# Altium schematic sheet МИЭТ_8161930_003_Э3_Лист_2.SchDoc: МИЭТ_8161930.003.Э3
size A4 portrait; Author: Архангельская П.Д.; SheetNumber: 2; SheetTotal: 2
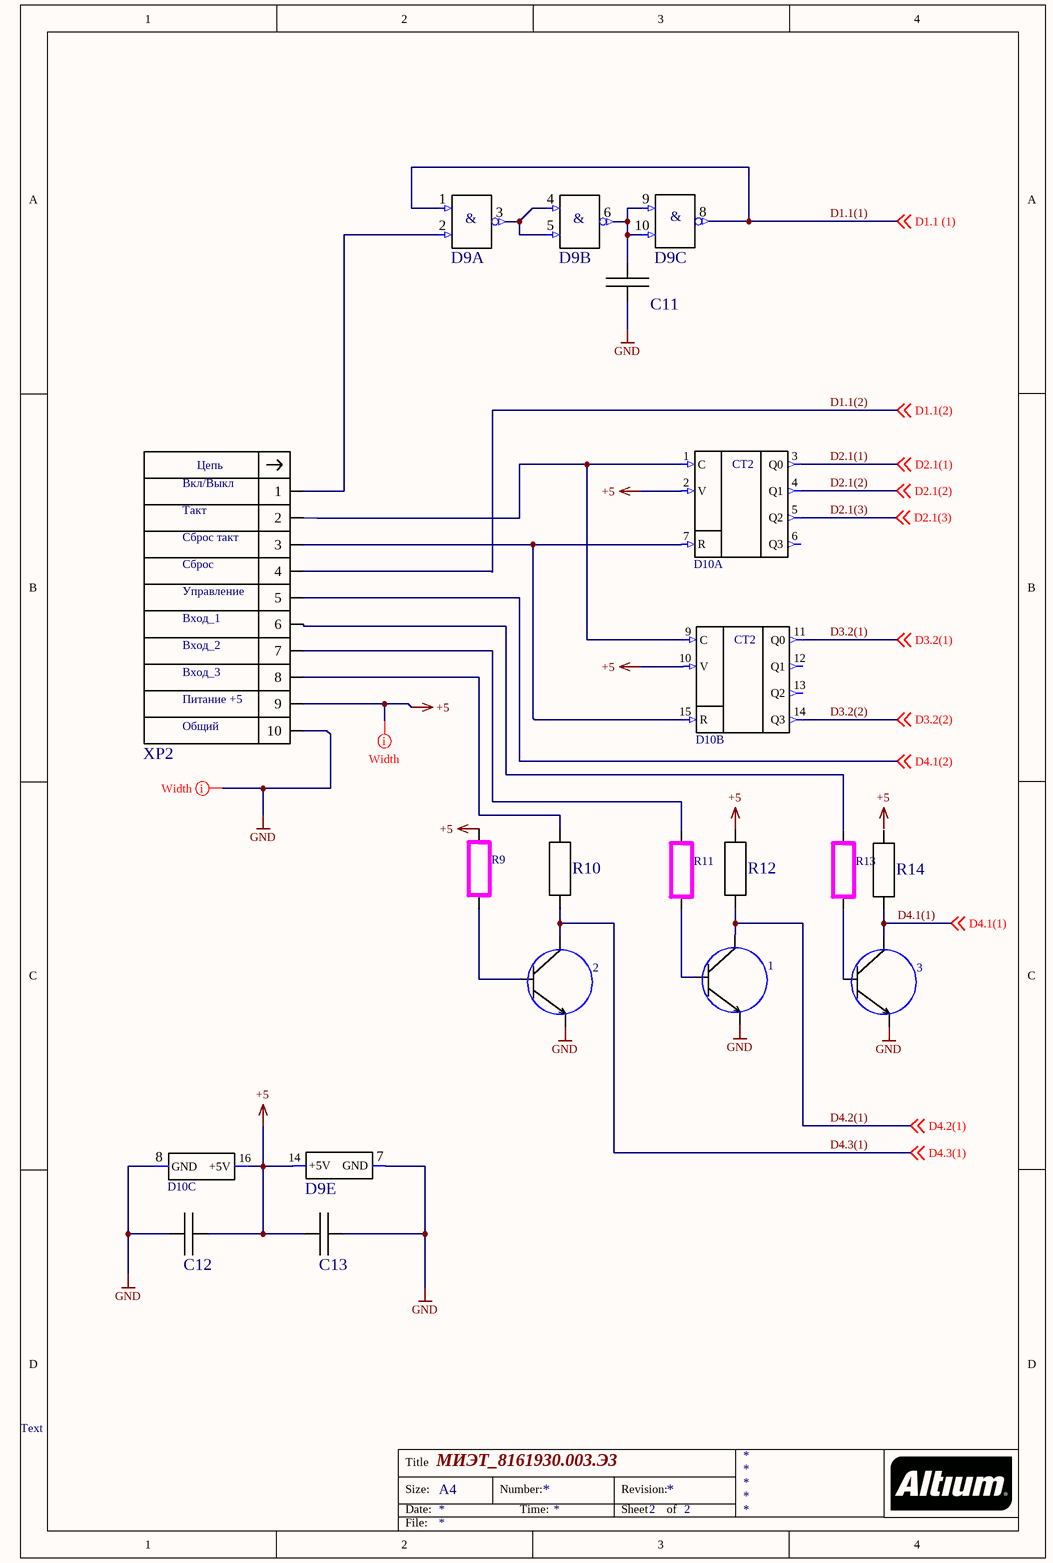
[diagram p0: МИЭТ_8161930_003_Э3_Лист_2.SchDoc]

## Parts
1  Транзистор  [SOT89-150P340X160-3N]  (value not drawn)
2  Транзистор  [SOT89-150P340X160-3N]  (value not drawn)
3  Транзистор  [SOT89-150P340X160-3N]  (value not drawn)
C11  (no value)  [0805_N]
C12  (no value)  [0805_N]
C13  (no value)  [0805_N]
D9  74AC00SC  [SO14-N]  (value not drawn)  (parts A,B,C,E of 5)
D10  MC14520BDWG  [SOIC-16W-N]  (value not drawn)  (parts A,B,C of 3)
R9  Резистор  [CAPC3225X06N]  (value not drawn)
R10  0805  [RES_0805_2012_N]  (value not drawn)
R11  Резистор  [CAPC3225X06N]  (value not drawn)
R12  0805  [RES_0805_2012_N]  (value not drawn)
R13  Резистор  [CAPC3225X06N]  (value not drawn)
R14  0805  [RES_0805_2012_N]  (value not drawn)
XP2  TE_1-1634689-0  [BH-10R]  (value not drawn)

## Nets
+5: C12.2 C13.1 D9.14(+5V) D10.2(V) D10.10(V) D10.16(+5V) R9.2 R12.2 XP2.9
GND: 1.3 2.3 3.3 C11.1 C12.1 C13.2 D9.7(GND) D10.8(GND) XP2.10
D1.1(1): D9.1(In1) D9.8(Out) ; off-sheet D1.1 (1)  [also labelled D1.1 (1)]
D1.1(2): XP2.4 ; off-sheet D1.1(2)
D2.1(1): D10.3(Q0) ; off-sheet D2.1(1)
D2.1(2): D10.4(Q1) ; off-sheet D2.1(2)
D2.1(3): D10.5(Q2) ; off-sheet D2.1(3)
D3.2(1): D10.11(Q0) ; off-sheet D3.2(1)
D3.2(2): D10.14(Q3) ; off-sheet D3.2(2)
D4.1(1): 3.1 R14.2 ; off-sheet D4.1(1)
D4.1(2): XP2.5 ; off-sheet D4.1(2)
D4.2(1): 1.1 R12.1 ; off-sheet D4.2(1)
D4.3(1): 2.1 R10.1 ; off-sheet D4.3(1)
Net1_2: 1.2 R11.1
Net2_2: 2.2 R9.1
Net3_2: 3.2 R13.1
NetC11_2: C11.2 D9.6(Out) D9.9(In1) D9.10(In2)
NetD9_2: D9.2(In2) XP2.1
NetD9_3: D9.3(Out) D9.4(In1) D9.5(In2)
NetD10_1: D10.1(C) D10.9(C) XP2.2
NetD10_7: D10.7(R) D10.15(R) XP2.3
NetR10_2: R10.2 XP2.8
NetR11_2: R11.2 XP2.7
NetR13_2: R13.2 XP2.6

Not connected (* = marked no-connect by the designer): D10 6(Q3) 12(Q1) 13(Q2); R14 1

## Layout directives
mark named Width: +5, GND

## Notes on the sheet
- Вкл/Выкл
- Такт
- (near XP2) Сброс такт
- Сброс
- (near XP2) Управление
- Вход_1
- Вход_2
- Вход_3
- (near XP2) Питание +5
- Общий
- Text
- Labels drawn without touching a wire or pin: +5
- Title
- Size:
- Date:
- A4
- Number:
- Time:
- Revision:
- Sheet
- of
- File:
- (in symbol 74AC00SC, part A) &
- (in symbol 74AC00SC, part B) &
- (in symbol 74AC00SC, part C) &
- (in symbol MC14520BDWG, part A) CT2
- (in symbol MC14520BDWG, part B) CT2
- (in symbol TE_1-1634689-0) Цепь

## Library data of the parts
1-3 = Транзистор: Транзистор 2Т665А9 АЕЯР.432140.605 ТУ
C11-C13 = К10-79_0805_Н90: Чип конденсатор 0805 Н90 ряд Е6; Manufacturer: ООО "Кулон"; Name: Конденсатор К10-79; Tolerance: +80%-20%; TU: АЖЯР.673511.004 ТУ; Type: K10-79; BOM: Конденсатор К10-79-*-B-*+80%-20%-Н90 АЖЯР.673511.004 ТУ; Created_by: Желобаев; Version: 0; Weight: 0.05; Voltage: *; TKE: Н90; Value: *; Value_KD: *; Case: 0805; Issue_date: 19_12_2018
D9 = 74AC00SC: 4 элемента 2И-НЕ TTL SOIC-14; Manufacturer: ON Semiconductor; BOM: Микросхема 74AC00SC "ON Semiconductor"; Created_by: Желобаев; Power_Voltage: 4.5 - 5.5 V; Name: Микросхема 74AC00SC; Issue_date: 10.04.2019; Case: SOIC-14; Version: 0
D10 = MC14520BDWG: Два двоичных счетчика; Manufacturer: Motorola; Created_by: Желобаев; Name: Микросхема MC14520BDWG; BOM: Микросхема MC14520BDWG "Motorola"; Issue_date: 6.01.2019; Version: 0; Case: SOIC-16
R9 R11 R13 = Резистор: Резистор Р1-12-0,1 4,7 кОм 5%-M-"A" АЛЯР.434110.005 ТУ
R10 R12 R14 = Р1-12-0,125-5%: Резистор от 0,75 Ом до 2 МОм; Manufacturer: ОАО "НПО "Эркон"; Reliability: 0,000001; LiveStatus: Производится; Tolerance: 5%; Created_by: Желобаев; TU: АЛЯР.434110.005 ТУ; Hight: 0,5; Voltage: 150; TKR: M; Name: Резистор Р1-12-0,125; BOM: Резистор Р1-12-0,125 * 5%-M-"A" АЛЯР.434110.005 ТУ; Issue_Date: 05_12_2018; Version: 00; ComponentLink1URL: https://www.erkon-nn.ru/catalog/rezistory-obshchego-primeneniya/; ComponentLink1Description: Сайт производителя; Type: Р1-12-0,125±5%-М-"А"; Weight: 0,01; Size: 0805; Value_KD: *
XP2 = TE_1-1634689-0: Вилка типа BH-10R угловая правая двухрядная 2х5х2.54; Manufacturer: TE Connectivity; Created_by: Желобаев; BOM: Вилка угловая TE_1-1634689-0 "TE Connectivity"; Name: Вилка угловая TE_1-1634689-0; Issue_date: 13.05.2019; Version: 0; Case: BH-10R